# Altium project QUTMS_ShutdownBoard_V2.PrjPcb
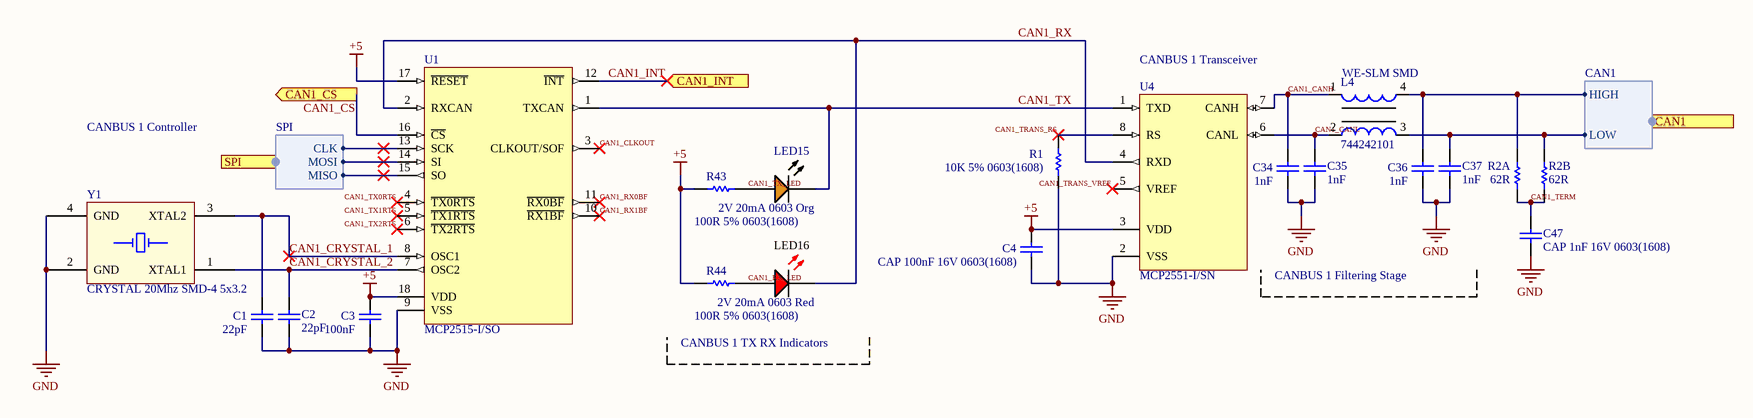
[diagram p0: CAN.SchDoc]
2 sheets, 21 parts. Net scope: flat (ports and power ports of the same name join across sheets).
Sheets:
  CAN.SchDoc
  BSPD.SchDoc

## Sheet CAN.SchDoc: Shutdown Board V2 - CAN Interface
size A3; Engineer: LK; Organization: Altium Limited; Address1: L3, 12a Rodborough Rd; Address2: Frenchs Forest; Address3: NSW; Address4: Australia 2086; Revision: A

### Parts
(Parts that share a designator on the sheet are numbered #1, #2 ... from top to bottom, then left to right.)
C1  22pF  [CAPC0603(1608)100_N]
C2  22pF  [CAPC0603(1608)100_N]
C3  100nF  [CAPC0603(1608)100_N]
C4  CAP 100nF 16V 0603(1608)  [CAPC0603(1608)100_N]
C34  1nF  [CAPC0603(1608)100_M]
C35  1nF  [CAPC0603(1608)100_M]
C36  1nF  [CAPC0603(1608)100_M]
C37  1nF  [CAPC0603(1608)100_M]
C47  CAP 1nF 16V 0603(1608)  [CAPC0603(1608)100_M]
L4  744242101  [WE-SLM]
LED15  2V 20mA 0603 Org  [KING-LED0603-25-ORANGE_V]
LED16  2V 20mA 0603 Red  [KING-LED0603-25-RED_V]
R1  10K 5% 0603(1608)  [RESC0603(1608)_N]
R2A  62R  [RESC0603(1608)_N]
R2B  62R  [RESC0603(1608)_N]
R43  100R 5% 0603(1608)  [RESC0603(1608)_L]
R44  100R 5% 0603(1608)  [RESC0603(1608)_L]
U1#1  MCP2515-I/SO  [SOIC-SO18_L]
U4  MCP2551-I/SN  [SOIC-SN8_N]
Y1  CRYSTAL 20Mhz SMD-4 5x3.2  [SMD-4_CRYSTAL_5x3.2mm]

### Ports
CAN1 (out, harness CAN1), CAN1_CS (out), CAN1_INT (in), SPI (out, harness SPI)

### Harnesses
CAN1: HIGH, LOW
SPI: CLK, MOSI, MISO

### Nets
+5: C3.2 C4.2 R43.2 R44.2 U1#1.17(~{RESET}) U1#1.18(VDD) U4.3(VDD)
GND: C1.1 C2.1 C3.1 C4.1 C34.1 C35.1 C36.1 C37.1 C47.1 R1.1 U1#1.9(VSS) U4.2(VSS) Y1.2(GND) Y1.4(GND)
CAN1_CANH: C34.2 L4.1 U4.7(CANH)
CAN1_CANL: C35.2 L4.2 U4.6(CANL)
CAN1_CLKOUT: U1#1.3(CLKOUT/SOF)
CAN1_CRYSTAL_1: C1.2 U1#1.8(OSC1) Y1.3(XTAL2)
CAN1_CRYSTAL_2: C2.2 U1#1.7(OSC2) Y1.1(XTAL1)
CAN1_CS: U1#1.16(~{CS}) ; port CAN1_CS
CAN1_INT: U1#1.12(~{INT}) ; port CAN1_INT
CAN1_RX: LED16.2(K) U1#1.2(RXCAN) U4.4(RXD)
CAN1_RX0BF: U1#1.11(~{RX0BF})
CAN1_RX1BF: U1#1.10(~{RX1BF})
CAN1_RX_LED: LED16.1(A) R44.1
CAN1_TERM: C47.2 R2A.1 R2B.1
CAN1_TRANS_RS: R1.2 U4.8(RS)
CAN1_TRANS_VREF: U4.5(VREF)
CAN1_TX: LED15.2(K) U1#1.1(TXCAN) U4.1(TXD)
CAN1_TX0RTS: U1#1.4(~{TX0RTS})
CAN1_TX1RTS: U1#1.5(~{TX1RTS})
CAN1_TX2RTS: U1#1.6(~{TX2RTS})
CAN1_TX_LED: LED15.1(A) R43.1
NetC36_2: C36.2 L4.4 R2A.2 ; port CAN1.HIGH
NetC37_2: C37.2 L4.3 R2B.2 ; port CAN1.LOW
NetU1#1_13: U1#1.13(SCK) ; port SPI.CLK
NetU1#1_14: U1#1.14(SI) ; port SPI.MOSI
NetU1#1_15: U1#1.15(SO) ; port SPI.MISO

### Notes on the sheet
- (near U4) CANBUS 1 Transceiver
- CANBUS 1 Controller
- (near L4) WE-SLM SMD
- (near U4) CANBUS 1 Filtering Stage
- CANBUS 1 TX RX Indicators
- Title
- Size:
- Date:
- A3
- Number:
- Time:
- Revision:
- Sheet
- of
- File:

### Library data of the parts
C1 C2 = CMP-1035-00808-1: CAP 22pF 16V ±5% 0603 (1608 Metric) Thickness 1mm SMD; Tolerance: Â±5%; Case-EIA: 0603; Case-Metric: 1608; Technology: SMT; Value: 22pF; Rated Voltage: 16 V; Max Thickness: 1 mm
C3 C4 = CMP-1035-02584-1: CAP 100nF 16V ±10% 0603 (1608 Metric) Thickness 1mm SMD; Tolerance: Â±10%; Case-EIA: 0603; Case-Metric: 1608; Technology: SMT; Max Thickness: 1 mm; Value: 100nF; Rated Voltage: 16 V
C34-C37 C47 = CMP-1035-01878-1: CAP 1nF 16V ±5% 0603 (1608 Metric) Thickness 1mm SMD; Case-Metric: 1608; Case-EIA: 0603; Tolerance: Â±5%; Rated Voltage: 16 V; Max Thickness: 1 mm; Technology: SMT; Value: 1nF
L4 = CMP-0222-00021-1: SMD Common Mode Line Filter WE-SLM, L = 100 µH; Inductance: 100 ÂµH; ComponentLink1Description: Manufacturer Link; ComponentLink2URL: http://www.we-online.de/katalog/media/pdf/744242101.pdf; PackageVersion: 2006; PackageReference: WE-SLM; PackageDescription: SMD Inductor, 4-Leads, Body 3.6 x 6.3 mm; ComponentLink1URL: http://www.we-online.com; ComponentLink2Description: Datasheet; DatasheetVersion: ver 3, Feb-2006
LED15 = CMP-0239-00002-1: LED, SMT, 0603(1608), 0.25mm Tthickness, Super Bright Orange; PartNumber: APG1608SEKC/T; Forward Current: 30 mA; Power Dissipation: 75 mW; Reverse Voltage: 5 V; Packing: Reel; PackageDescription: 2-Pin SMT LED, 1.6 x 0.8 mm Body, 0.25mm Thickness; ComponentLink1URL: http://www.kingbrightusa.com/; PackageVersion: Rev. 4A, 12/2011; Storage Temperature: -40 to 85 degC; Mounting Technology: Surface Mount; ComponentLink2Description: Datasheet; DatasheetVersion: Rev. 4A, 12/2011; ComponentLink2URL: http://www.kingbrightusa.com/images/catalog/SPEC/APG1608SEKC-T.pdf; PackageReference: LED0603-25-ORANGE; ComponentLink1Description: Manufacturer URL
LED16 = CMP-0404-00004-1: Ultra Thin Hyper Red SMD Chip LED Lamp, 2 to 2.5 V, -40 to 85 degC, Body 1.6 x 0.8 mm, 0.28 mm Thickness, RoHS, Tape and Reel; Manufacturer: Kingbright; PartNumber: APG1608SURKC/T; Dice: Hyper Red (AlGaInP); IR (Max): 10 uA; Luminous Intensity mcd @ 20 mA (Min.): 55; Lens Type: Water Clear; Viewing Angle: 120; Luminous Intensity mcd @ 20 mA (Typ.): 110; ComponentLink2Description: Datasheet; ComponentLink3URL: http://www.kingbrightusa.com/images/catalog/SPEC/APG1608SURKC-T.pdf; Packing: Tape and Reel; Mounting Technology: Surface Mount; PackageVersion: Rev. V.5A; ComponentLink1Description: Manufacturer URL; ComponentLink2URL: http://www.kingbrightusa.com/images/catalog/SPEC/APG1608SURKC-T.pdf; ComponentLink3Description: Package Specification; PackageDescription: 2-Pin SMT, Body 1.6 x 0.8 mm, 0.28mm Thickness, Red; PackageReference: LED0603-25-RED; DatasheetVersion: Rev. V.5A; Operating Temperature: -40 to 85 degC; ComponentLink1URL: http://www.kingbrightusa.com/; Forward Voltage: 2 to 2.5 V; RoHS: TRUE
R1 = CMP-1012-00098-1: 10K 0.1W 5% 0603 (1608 Metric)  SMD; Case-EIA: 0603; Value: 10000.00 Ohm; Case-Metric: 1608; Technology: SMT; Tolerance: 5 %; Power: 0.1 W
R2A R2B = CMP-1012-00373-1: 62R 0.1W 1% 0603 (1608 Metric)  SMD; Case-EIA: 0603; Case-Metric: 1608; Value: 62.00 Ohm; Power: 0.1 W; Technology: SMT; Tolerance: 1 %
R43 R44 = CMP-1012-00050-1: 100R 0.1W 5% 0603 (1608 Metric)  SMD; Case-EIA: 0603; Value: 100.00 Ohm; Case-Metric: 1608; Tolerance: 5 %; Technology: SMT; Power: 0.1 W
U1#1 = CMP-0186-00133-2: Stand-Alone CAN Controller With SPI Interface, 18-Pin SOIC, Industrial Temperature; ComponentLink2Description: Datasheet; RevisionNote: URLs added. DatasheetVersion updated.; PackageVersion: revBB, Aug-2009; ComponentLink1URL: http://www.microchip.com/; PackageReference: SOIC-SO18; PackageDescription: 18-Lead Plastic Small Outline (SO) - Wide 7.50mm Body [SOIC]; DatasheetVersion: revF, Oct-2010; ComponentLink2URL: http://ww1.microchip.com/downloads/en/DeviceDoc/21801f.pdf; ComponentLink3URL: http://www.microchip.com/stellent/groups/techpub_sg/documents/packagingspec/en012702.pdf; Code_JEDEC: MS-013; ComponentLink3Description: Package Specification; ComponentLink1Description: Manufacturer URL
U4 = CMP-0186-00138-2: High-Speed CAN Transceiver, 8-Pin SOIC, Industrial Temperature; Code_JEDEC: MS-012; ComponentLink3URL: http://www.microchip.com/stellent/groups/techpub_sg/documents/packagingspec/en012702.pdf; DatasheetVersion: revF, Jul-2010; PackageVersion: revBB, Aug-2009; PackageDescription: 8-Lead Plastic Small Outline (SN) - Narrow, 3.90mm Body [SOIC]; ComponentLink1URL: http://www.microchip.com/; ComponentLink3Description: Package Specification; ComponentLink2Description: Datasheet; Code_IPC: SOIC127P600-8; ComponentLink1Description: Manufacturer URL; PackageReference: SOIC-SN8; ComponentLink2URL: http://ww1.microchip.com/downloads/en/DeviceDoc/21667F.pdf; RevisionNote: URLs added. DatasheetVersion updated.
Y1 = CYRYSTAL_SMD-4

## Sheet BSPD.SchDoc: Brake System Plausibility Device
size A4
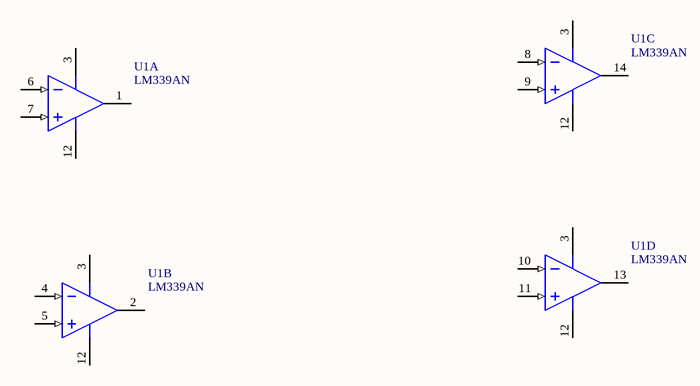
[diagram p1: BSPD.SchDoc]

### Parts
(Parts that share a designator on the sheet are numbered #1, #2 ... from top to bottom, then left to right.)
U1#2  LM339AN  [TI-N0014A]  (parts A,B,C,D of 4)

### Nets

Not connected (* = marked no-connect by the designer): U1#2 1(OUT1) 2(OUT2) 3(VCC) 4(IN2-) 5(IN2+) 6(IN1-) 7(IN1+) 8(IN3-) 9(IN3+) 10(IN4-) 11(IN4+) 12(GND) 13(OUT4) 14(OUT3)

### Library data of the parts
U1#2 = CMP-018-00002-1: Quad Differential Comparator, 2 to 30 V, 0 to 70 degC, 14-Pin DIP (N), Pb-Free (RoHS), Tube; Manufacturer: Texas Instruments; Max Dual Supply Voltage: 15V; Nominal Supply Current: 500uA; Power: 1.05W; Elements: 4; Max Supply Voltage: 30V; Nominal Voltage Gain: 106.02dB; Min Dual Supply Voltage: 1V; Min Supply Voltage: 2V; RoHS Compliant: True; Packaging: Rail/Tube; Package Quantity: 25; Package Reference: N-14; Package URL: http://www.ti.com/lit/ml/mpdi002c/mpdi002c.pdf; Max Operating Temperature: 70°C; Package Description: 14-Pin Double In-line Package, Body 19.305 x 6.35 mm, Pitch 2.54 mm; Pins: 14; Manufacturer URL: http://www.ti.com/; Case/Package: PDIP; Datasheet Version: SLCS006S, 08/2012; Mounting Technology: TH; Datasheet URL: http://www.ti.com/general/docs/lit/getliterature.tsp?genericPartNumber=LM339A&fileType=pdf; Min Operating Temperature: 0°C